# Altium schematic sheet ChargingController.SchDoc
size A
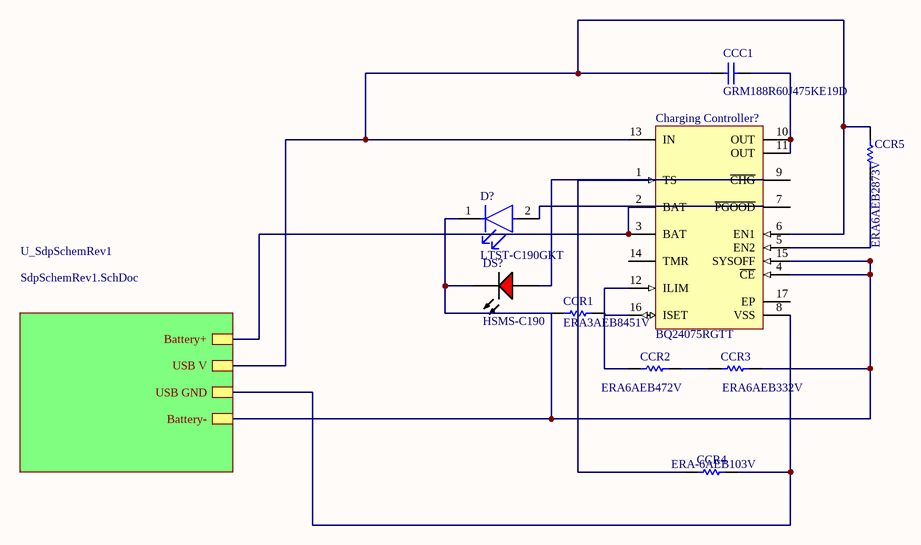
[diagram p0: ChargingController.SchDoc]

## Parts
CCC1  GRM188R60J475KE19D  [CAPC1608X90X35ML10T15]
CCR1  ERA3AEB8451V  [RESC1608X55X30ML20T20]
CCR2  ERA6AEB472V  [RESC2013X60X40ML20T25]
CCR3  ERA6AEB332V  [RESC2013X60X40NL20T25]
CCR4  ERA-6AEB103V  [RESC2013X60X40LL20T25_A]
CCR5  ERA6AEB2873V  [RESC2013X60X40LL20T25]
Charging_Controller?  BQ24075RGTT  [RGT0016C_V]
D?  LTST-C190GKT  [FP-LTST-C190GKT-MFG]
DS?  HSMS-C190  [AVAG-HSMX-C190_V]

## Sub-sheets
U_SdpSchemRev1 = SdpSchemRev1.SchDoc: Battery+, USB V, USB GND, Battery-

## Nets
NetCCC1_1: CCC1.1 CCR5.2 Charging_Controller?.6(EN1) Charging_Controller?.13(IN) ; sheet U_SdpSchemRev1/USB V
NetCCC1_2: CCC1.2 Charging_Controller?.10(OUT) Charging_Controller?.11(OUT)
NetCCR1_1: CCR1.1 CCR3.2 Charging_Controller?.4(~{CE}) Charging_Controller?.15(SYSOFF) D?.1(C) DS?.2(K) ; sheet U_SdpSchemRev1/Battery-
NetCCR1_2: CCR1.2 CCR2.1 Charging_Controller?.12(ILIM) Charging_Controller?.16(ISET)
NetCCR2_2: CCR2.2 CCR3.1
NetCCR4_1: CCR4.1 Charging_Controller?.1(TS) DS?.1(A)
NetCCR4_2: CCR4.2 Charging_Controller?.8(VSS) ; sheet U_SdpSchemRev1/USB GND
NetCCR5_1: CCR5.1 Charging_Controller?.5(EN2)
NetCharging_Controller?_2: Charging_Controller?.2(BAT) Charging_Controller?.3(BAT) ; sheet U_SdpSchemRev1/Battery+

Not connected (* = marked no-connect by the designer): Charging_Controller? 7(~{PGOOD}) 9(~{CHG}) 14(TMR) 17(EP); D? 2(A)

## Library data of the parts
CCC1 = CMP-2006-02799-2: Chip Capacitor, 4.7 uF, +/- 10%, 6.3 V, -55 to 85 degC, 0603 (1608 Metric), RoHS, Tape and Reel; Voltage Rating (DC): 3 V; Voltage Rating: 6.3 V; Type (Capacitors): X5R; Capacitance: 4.7 uF; Case/Package: 0603; Case Code (Imperial): 0603; Packaging: Tape and Reel; Mount: Surface Mount; Height: 0.8 mm; REACH SVHC: No SVHC; ComponentLink1URL: http://www.murata.com/; ComponentLink2URL: http://psearch.en.murata.com/capacitor/product/GRM188R60J475KE19%23.pdf; Min Operating Temperature: -55 degC; Max Operating Temperature: 85 degC; Length: 1.6 mm; Case Code (Metric): 1608; Radiation Hardening: No; PackageDescription: 2-Pin Surface Mount Device, Body 1.6 x 0.8 mm; RoHSCompliant: true; PartNumber: GRM188R60J475KE19D; Tolerance: 10%; Width: 0.8 mm; ComponentLink1Description: Manufacturer URL; Mounting Technology: Surface Mount; ComponentLink2Description: Datasheet; Package Quantity: 4000; DatasheetVersion: 08/2016
CCR1 = CMP-2000-00133-1: Manufacturer: Panasonic; Part Number: ERA3AEB8451V
CCR2 = CMP-2001-00644-1: Manufacturer: Panasonic; Part Number: ERA6AEB472V
CCR3 = CMP-2001-00629-1: Manufacturer: Panasonic; Part Number: ERA6AEB332V
CCR4 = CMP-2000-06228-1: Metal Film Chip Resistor, High Reliability Type, 0.125 W, +/- 0.1%, -55 to 155 degC, 0805 (2012 Metric), RoHS, Tape and Reel; Voltage Rating: 100V; Power Rating: 125mW(1/8W); Brand: Panasonic; Temperature Coefficient: 25PPM/C; Resistance: 10kOhms; Product Category: ThinFilmResistors-SMD; Datasheet Version: 02/2016; Operating Temperature Range: -55Cto+155C; Length: 2mm; Mounting Technology: SurfaceMount; Manufacturer URL: http://www.panasonic.com/; Width: 1.25mm; Packaging: Reel; Product: ThinFilmResistorsSMD; Package / Case: 0805(2012metric); Termination Style: SMD/SMT; Tolerance: 0.1%; Datasheet URL: https://industrial.panasonic.com/cdbs/www-data/pdf/RDM0000/AOA0000C307.pdf; Package Description: 2-Pin Surface Mount Device, Body 2 x 1.25 mm; Factory Pack Quantity: 5000; Series: ERA-6A; Case Code - mm: 2012; RoHS: Details; Package Reference: 0805; Height: 0.5mm; Manufacturer: Panasonic; Case Code - in: 0805; Type: MetalFilmChipResistors
CCR5 = CMP-2001-00791-1: Manufacturer: Panasonic; Part Number: ERA6AEB2873V
Charging_Controller? = CMP-0321-00236-2: USB-Friendly Li-Ion Battery Charger and Power-Path Management IC, Vout 5.5 V, 4.3 V, -40 to 85 degC, 16-pin QFN (RGT), Green (RoHS & no Sb/Br); Manufacturer: Texas Instruments; Vin(Min)(V): 4.3; SubFamily: Battery Charge Management; NiMH: N; PackageDescription: 16-Pin Plastic Quad Flat No-Lead, 3 x 3 mm Body, 0.5 mm Pitch, 1.7 x 1.7 mm Exposed Pad; PartNumber: BQ24075RGTT; PackageVersion: revH, Oct-2011; Eco-Plan: Green (RoHS & no Sb/Br); Code_JEDEC: MO-220; ComponentLink1Description: Datasheet; PackageReference: RGT0016C; NiCd: N; Li-Polymer: N; DatasheetVersion: SLUS810G; ComponentLink1URL: http://www.ti.com/general/docs/lit/getliterature.tsp?genericPartNumber=BQ24075&fileType=pdf; Over Voltage Protection: N; Mounting Technology: Surface Mount; Lead Acid: N; Li-Ion: N
D? = CMP-22017-000018-1: LED GREEN CLEAR CHIP SMD; Dominant Wavelength: 569nm; Reverse Voltage: 5V; Lens Color: Colorless; Viewing Angle: 130°; Voltage: 2V; Forward Current: 30mA; Power Dissipation: 100mW; Luminous Intensity: 6mcd; Number of LEDs: 1; Forward Voltage: 2.1V; Wavelength: 565nm; Test Current: 10mA; Min Operating Temperature: -55°C; Lens Style: Clear; Mount: Surface Mount; Width: 0.8mm; Packaging: Tape and Reel; Lens Transparency: Clear; Case Code (Metric): 1608; Depth: 0.8mm; Case Code (Imperial): 0603; Case/Package: 0603; Number of Pins: 2; Max Operating Temperature: 85°C; Lead Free: Lead Free; Number of Elements: 1; Length: 1.6mm; Height: 0.8mm; Package Quantity: 1; Power Rating: 100mW; Radiation Hardening: No; Illumination Color: Green; Color: Green
DS? = CMP-2000-06427-1: LED Uni-Color Red, 52 mW, 20 mA, -40 to 85 degC, 2-Pin SMD, RoHS, Tape and Reel; Manufacturer: Avago; Reverse Voltage: 5V; Viewing Angle: 170deg; High Brightness: No; Lens Type: ColorlessDiffused; DELETED: Compliant; Product Height (mm): 0.8mm; Dominant Wave Length: 626nm; Number of  Elements: 1; Chip Material: GaP; Lum Intensity: 10mcd; Product Length (mm): 1.6mm; Forward Voltage: 2.6V; Power Dissipation: 52W; Shape Type: Rectangular; Forward Current: 25mA; Peak Wavelength: 630nm; Test Current (It): 20mA; Main Category: ChipLED; Lens Dimensions: 1x0.8x0.5mm; Pin Count: 2; Package Reference: HSMX-C190; Mounting Technology: SurfaceMount; Mounting: SurfaceMount; Datasheet URL: http://docs.avagotech.com/docs/AV02-0551EN; Package Type: ChipLed; Operating Temperature Classification: Industrial; Datasheet Version: 03/2012; Operating Temp Range: -40Cto85C; Emitting Color: Red; Rad Hardened: No; Manufacturer URL: http://www.avagotech.com/; Luminous Intensity: 10mcd; Package Description: 2-Pin Surface Mount Device, Body 1.6 x 0.8 mm, Height 0.9 mm; Type: Uni-Color; Packaging: TapeandReel; Product Depth (mm): 0.8mm